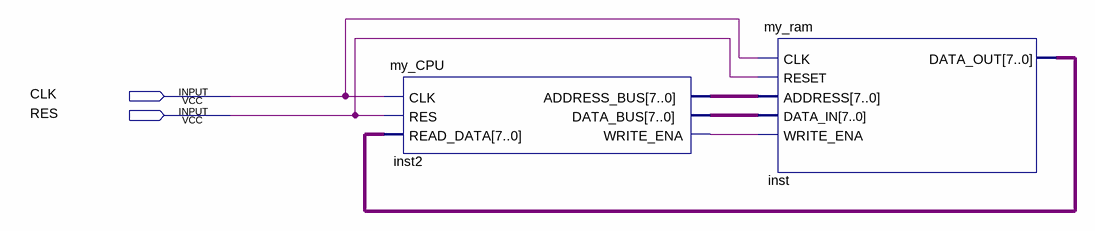
[diagram p0: schematic sheet]
// Quartus schematic my_8_bit_processor.bdf as structural Verilog: 2 symbols, 2 pins
module my_8_bit_processor (
  input  CLK,
  input  RES
);

  wire inst2_write_ena;
  wire [7:0] inst2_address_bus, inst2_data_bus, inst_data_out;

  my_CPU inst2 (
    .CLK(CLK), .RES(RES), .READ_DATA(inst_data_out), .ADDRESS_BUS(inst2_address_bus),
    .DATA_BUS(inst2_data_bus), .WRITE_ENA(inst2_write_ena));
  my_ram inst (
    .CLK(CLK), .RESET(RES), .ADDRESS(inst2_address_bus), .DATA_IN(inst2_data_bus),
    .WRITE_ENA(inst2_write_ena), .DATA_OUT(inst_data_out));
endmodule
